# Altium schematic sheet CANbus.SchDoc
size A; SheetNumber: 3; SheetTotal: 15
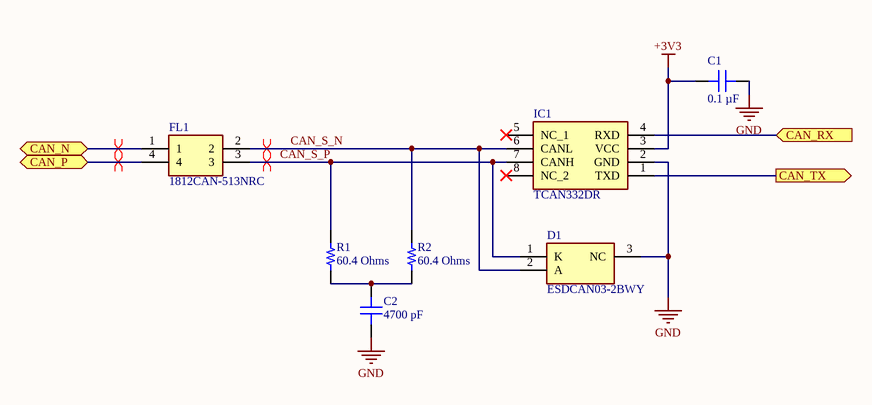
[diagram p0: CANbus.SchDoc]

## Parts
C1  0.1 µF  [CAP 0402_1005]
C2  4700 pF  [CAP 0402_1005]
D1  ESDCAN03-2BWY  [SOT65P210X110-3N]
FL1  1812CAN-513NRC  [1812CAN513NRC]
IC1  TCAN332DR  [SOIC127P600X175-8N]
R1  60.4 Ohms  [RES 0402_1005]
R2  60.4 Ohms  [RES 0402_1005]

## Ports
CAN_N (bidir), CAN_P (bidir), CAN_RX (in), CAN_TX (out)

## Nets
+3V3: C1.1 IC1.3(VCC)
GND: C1.2 C2.1 D1.3(NC) IC1.2(GND)
CAN_N: FL1.1 ; port CAN_N
CAN_P: FL1.4 ; port CAN_P
CAN_RX: IC1.4(RXD) ; port CAN_RX
CAN_S_N: D1.2(A) FL1.2 IC1.6(CANL) R2.1
CAN_S_P: D1.1(K) FL1.3 IC1.7(CANH) R1.1
CAN_TX: IC1.1(TXD) ; port CAN_TX
NetC2_2: C2.2 R1.2 R2.2

Not connected (* = marked no-connect by the designer): IC1 5(NC_1)* 8(NC_2)*

## Layout directives
differential pair: CAN_N, CAN_P, CAN_S_N, CAN_S_P

## Library data of the parts
C1 = C0402C104K4RECAUTO: CAP CER 0402 0.1UF 16V X7R 10%; manufacturer: KEMET; Part Number: C0402C104K4RECAUTO; Capacitance: 0.1 µF; Applications: Automotive, ESD Protection; componentlink1description: Datasheet; componentlink1url: https://api.kemet.com/component-edge/download/datasheet/C0402C104K4RECAUTO.pdf; componentlink2description: DigiKey Link; componentlink2url: https://www.digikey.com/en/products/detail/kemet/C0402C104K4RECAUTO/8563695; Device Package: 0402 (1005 Metric); lastupdated: 2/9/2024 8:04:38 PM; Lifecycle Status: Active; Minimum Order: 1; Mounting Type: Surface Mount, MLCC; Operating Temperature: -55°C ~ 125°C; Package / Case: 0402 (1005 Metric); packaging: TapeAndReel; partid: 1731; Part Status: Active; price: 0.01; Ratings: AEC-Q200; series: ESD SMD Auto X7R; Size / Dimension: 0.039" L x 0.020" W (1.00mm x 0.50mm); Supplier 1: DigiKey; Supplier Part Number 1: 399-17167-1-ND; Temperature Coefficient: X7R; Thickness (Max): 0.022" (0.55mm); Tolerance: ±10%; value: 0.1 µF; Voltage - Rated: 16V
C2 = C0402C472K4RECAUTO: CAP CER 0402 4.7NF 16V X7R 10%; manufacturer: KEMET; Part Number: C0402C472K4RECAUTO; Capacitance: 4700 pF; Applications: Automotive, ESD Protection; componentlink1description: Datasheet; componentlink1url: https://api.kemet.com/component-edge/download/datasheet/C0402C472K4RECAUTO.pdf; componentlink2description: DigiKey Link; componentlink2url: https://www.digikey.com/en/products/detail/kemet/C0402C472K4RECAUTO/8640469; Device Package: 0402 (1005 Metric); lastupdated: 2/9/2024 8:04:21 PM; Lifecycle Status: Active; Minimum Order: 1; Mounting Type: Surface Mount, MLCC; Operating Temperature: -55°C ~ 125°C; Package / Case: 0402 (1005 Metric); packaging: TapeAndReel; partid: 12122; Part Status: Active; price: 0.01; Ratings: AEC-Q200; series: ESD SMD Auto X7R; Size / Dimension: 0.039" L x 0.020" W (1.00mm x 0.50mm); Supplier 1: DigiKey; Supplier Part Number 1: 399-17875-1-ND; Temperature Coefficient: X7R; Thickness (Max): 0.022" (0.55mm); Tolerance: ±10%; value: 4700 pF; Voltage - Rated: 16V
D1 = ESDCAN03-2BWY: TVS Diode (Uni-directional); Manufacturer_Name: STMicroelectronics; Datasheet Link: https://www.mouser.de/datasheet/2/389/esdcan02-2bwy-954689.pdf; Height: 1.1mm; Manufacturer_Part_Number: ESDCAN03-2BWY; Mouser Part Number: 511-ESDCAN03-2BWY; Mouser Price/Stock: https://www.mouser.co.uk/ProductDetail/STMicroelectronics/ESDCAN03-2BWY?qs=FqY30PPN9V2iiokjuqa22Q%3D%3D; Arrow Part Number: ESDCAN03-2BWY; Arrow Price/Stock: https://www.arrow.com/en/products/esdcan03-2bwy/stmicroelectronics?region=nac
FL1 = 1812CAN-513NRC: Filter; Manufacturer_Name: COILCRAFT; Datasheet Link: https://www.coilcraft.com/getmedia/07970769-ca48-411d-9c96-6ae867bbb31e/1812can.pdf; Height: 3mm; Manufacturer_Part_Number: 1812CAN-513NRC; Mouser Part Number: 994-1812CAN-513NRC; Mouser Price/Stock: https://www.mouser.co.uk/ProductDetail/Coilcraft/1812CAN-513NRC?qs=wnTfsH77Xs4YqxEo%2FcWzJA%3D%3D
IC1 = TCAN332DR: Integrated Circuit; Manufacturer_Name: Texas Instruments; Datasheet Link: http://www.ti.com/lit/ds/symlink/tcan332.pdf; Height: 1.75mm; Manufacturer_Part_Number: TCAN332DR; Mouser Part Number: 595-TCAN332DR; Mouser Price/Stock: https://www.mouser.co.uk/ProductDetail/Texas-Instruments/TCAN332DR?qs=n%252BTO0c4TDSYIUeM9WmVMtA%3D%3D; Arrow Part Number: TCAN332DR; Arrow Price/Stock: https://www.arrow.com/en/products/tcan332dr/texas-instruments?region=nac
R1 R2 = CRCW040260R4FKED: RES SMD 60.4 OHM 1% 1/16W 0402; Manufacturer: Vishay Dale; Power (Watts): 0.063W, 1/16W; Temperature Coefficient: ±100ppm/°C; Part Number: CRCW040260R4FKED; Value: 60.4 Ohms; ComponentLink1Description: Datasheet; ComponentLink1URL: http://www.vishay.com/docs/20035/dcrcwe3.pdf; ComponentLink2Description: DigiKey Link; ComponentLink2URL: https://www.digikey.com/en/products/detail/vishay-dale/CRCW040260R4FKED/1177868; Composition: Thick Film; Device Package: 0402 (1005 Metric); Features: Automotive AEC-Q200; Height - Seated (Max): 0.016" (0.40mm); LastUpdated: 2/9/2024 8:29:54 PM; Lifecycle Status: Active; Minimum Order: 1; Number of Terminations: 2; Operating Temperature: -55°C ~ 155°C; Package / Case: 0402 (1005 Metric); Packaging: TapeAndReel; PartId: 10502; Part Status: Active; Price: 0.01; Ratings: AEC-Q200; Resistance: 60.4 Ohms; Series: CRCW; Size / Dimension: 0.039" L x 0.020" W (1.00mm x 0.50mm); Supplier 1: DigiKey; Supplier Part Number 1: 541-60.4LCT-ND; Supplier Device Package: 0402; Tolerance: ±1%